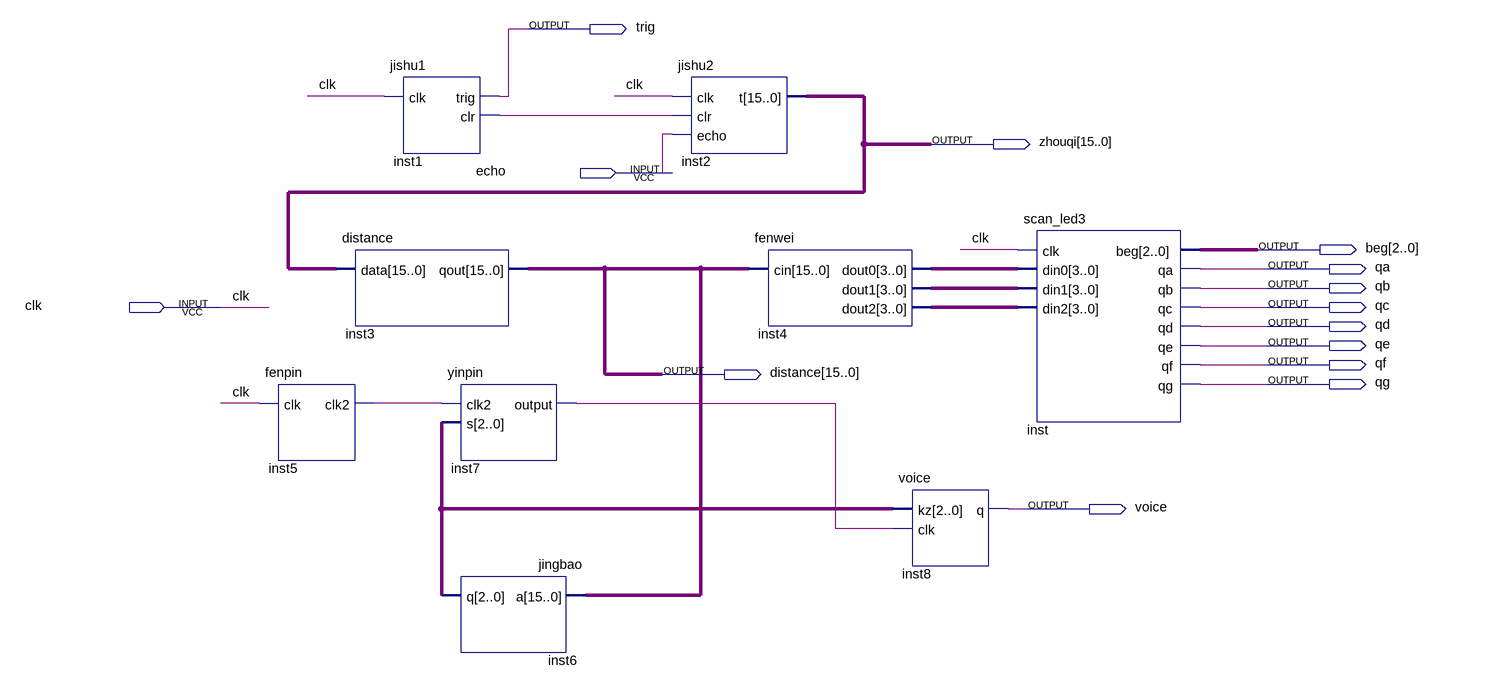
[diagram p0: schematic sheet]
// Quartus schematic zonghe.bdf as structural Verilog: 9 symbols, 14 pins
module zonghe (
  input  echo,
  input  clk,
  output trig,
  output [15:0] zhouqi,
  output [2:0] beg,
  output qa,
  output qb,
  output qc,
  output qd,
  output qe,
  output qf,
  output [15:0] distance,
  output qg,
  output voice
);

  wire inst1_clr, inst5_clk2, inst7_output;
  wire [2:0] inst6_q;
  wire [3:0] inst4_dout0, inst4_dout1, inst4_dout2;

  fenpin inst5 (.clk(clk), .clk2(inst5_clk2));
  jishu1 inst1 (.clk(clk), .trig(trig), .clr(inst1_clr));
  distance inst3 (.data(zhouqi), .qout(distance));
  yinpin inst7 (.clk2(inst5_clk2), .s(inst6_q), .\output (inst7_output));
  jingbao inst6 (.a(distance), .q(inst6_q));
  jishu2 inst2 (.clk(clk), .clr(inst1_clr), .echo(echo), .t(zhouqi));
  fenwei inst4 (.cin(distance), .dout0(inst4_dout0), .dout1(inst4_dout1), .dout2(inst4_dout2));
  voice inst8 (.kz(inst6_q), .clk(inst7_output), .q(voice));
  scan_led3 inst (
    .clk(clk), .din0(inst4_dout0), .din1(inst4_dout1), .din2(inst4_dout2), .beg(beg), .qa(qa), .qb(qb),
    .qc(qc), .qd(qd), .qe(qe), .qf(qf), .qg(qg));
endmodule
